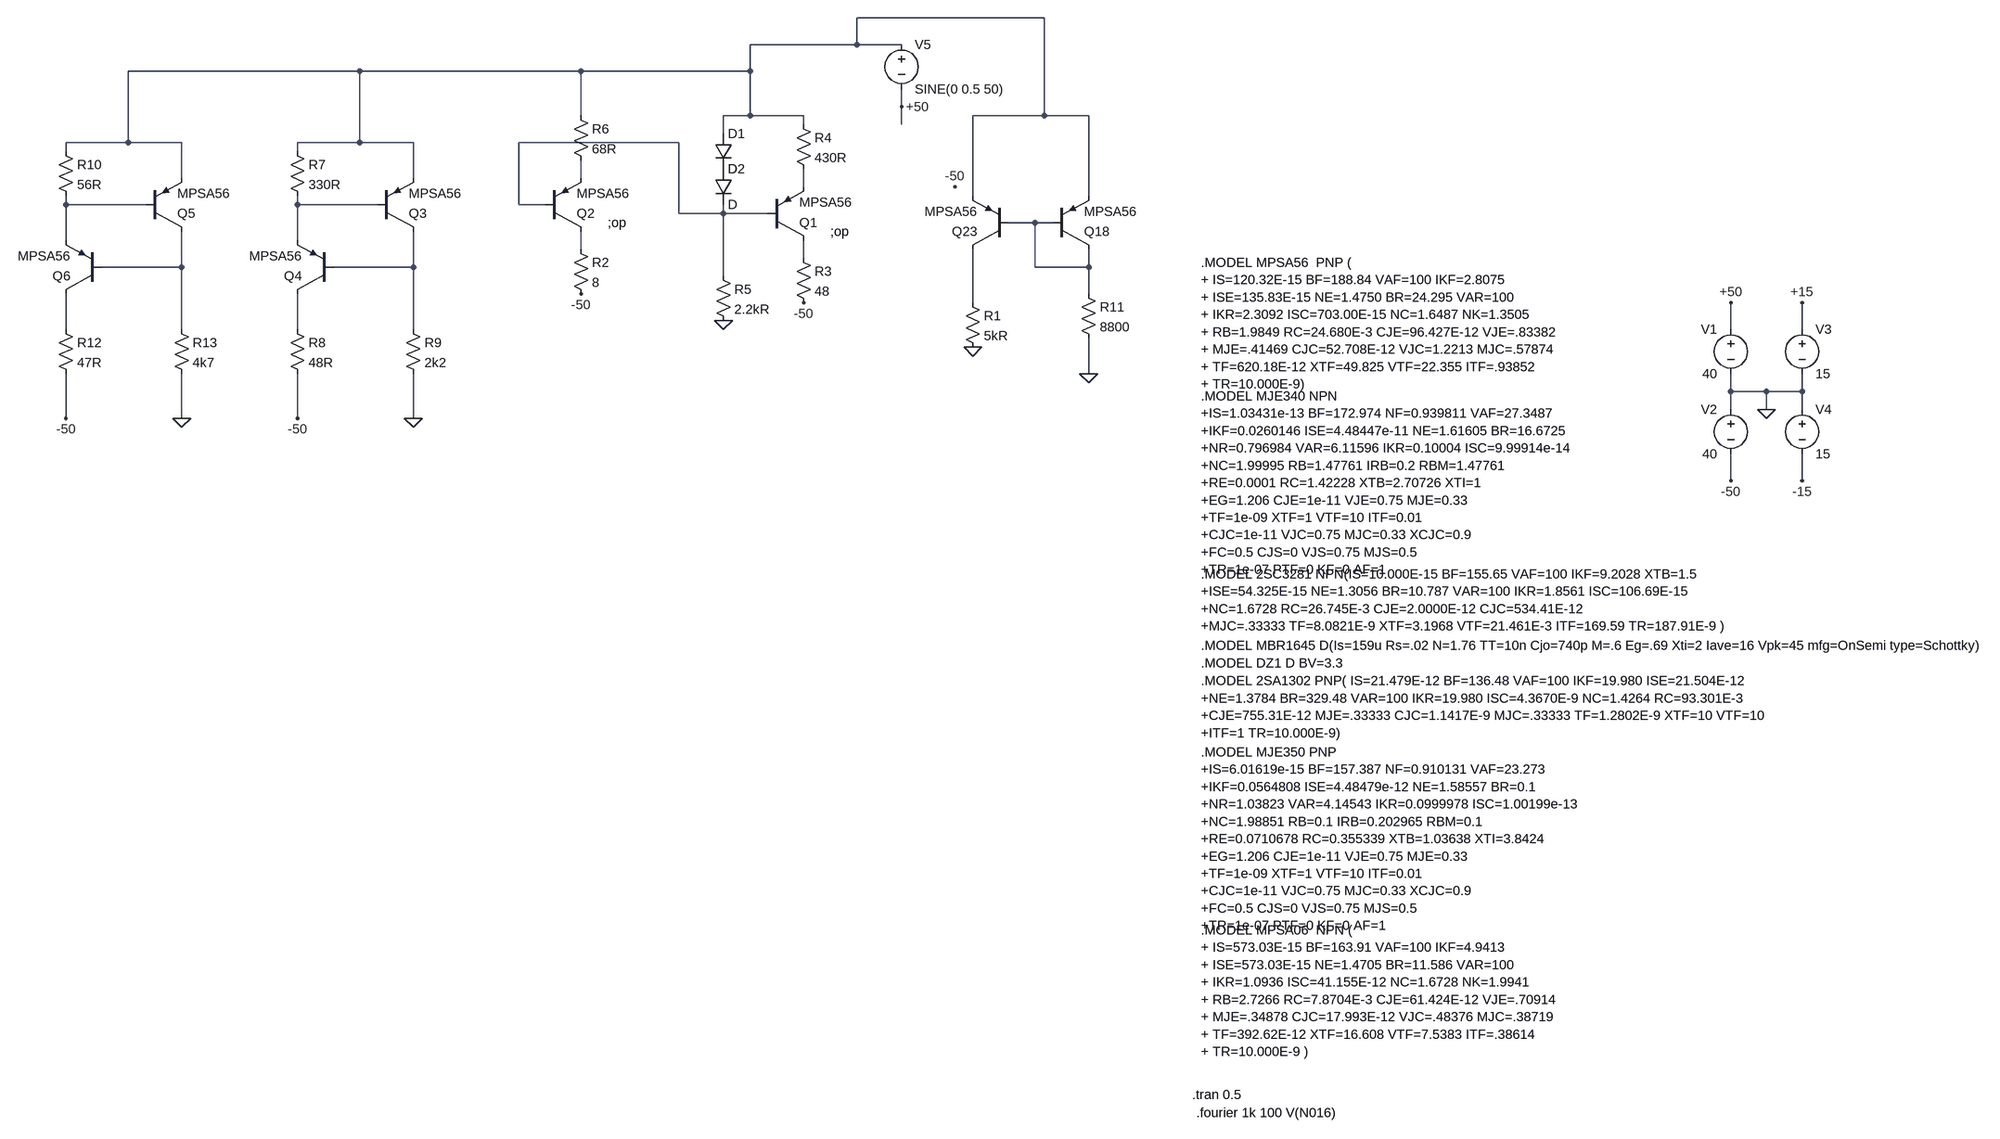
[diagram p0: schematic fuente_g.asc]
fuente_g.asc, the LTspice schematic file:
Version 4
SHEET 1 4608 680
WIRE 112 -1760 -224 -1760
WIRE -224 -1712 -224 -1760
WIRE -224 -1712 -416 -1712
WIRE -144 -1712 -224 -1712
WIRE -1184 -1664 -1600 -1664
WIRE -720 -1664 -1184 -1664
WIRE -416 -1664 -416 -1712
WIRE -416 -1664 -720 -1664
WIRE -144 -1600 -144 -1632
WIRE -720 -1584 -720 -1664
WIRE -416 -1584 -416 -1664
WIRE -416 -1584 -464 -1584
WIRE -320 -1584 -416 -1584
WIRE 112 -1584 112 -1760
WIRE 112 -1584 -16 -1584
WIRE 192 -1584 112 -1584
WIRE -320 -1568 -320 -1584
WIRE -144 -1568 -144 -1600
WIRE -464 -1552 -464 -1584
WIRE -1600 -1536 -1600 -1664
WIRE -1600 -1536 -1712 -1536
WIRE -1504 -1536 -1600 -1536
WIRE -1184 -1536 -1184 -1664
WIRE -1184 -1536 -1296 -1536
WIRE -1088 -1536 -1184 -1536
WIRE -544 -1536 -832 -1536
WIRE -1712 -1520 -1712 -1536
WIRE -1296 -1520 -1296 -1536
WIRE -1504 -1472 -1504 -1536
WIRE -1088 -1472 -1088 -1536
WIRE -720 -1472 -720 -1504
WIRE -320 -1472 -320 -1488
WIRE -320 -1456 -320 -1472
WIRE -16 -1440 -16 -1584
WIRE 192 -1440 192 -1584
WIRE -1712 -1424 -1712 -1440
WIRE -1568 -1424 -1712 -1424
WIRE -1296 -1424 -1296 -1440
WIRE -1152 -1424 -1296 -1424
WIRE -832 -1424 -832 -1536
WIRE -784 -1424 -832 -1424
WIRE -544 -1408 -544 -1536
WIRE -464 -1408 -464 -1424
WIRE -464 -1408 -544 -1408
WIRE -384 -1408 -464 -1408
WIRE 96 -1392 48 -1392
WIRE 128 -1392 96 -1392
WIRE -1712 -1360 -1712 -1424
WIRE -1296 -1360 -1296 -1424
WIRE -720 -1344 -720 -1376
WIRE -320 -1328 -320 -1360
WIRE -1504 -1312 -1504 -1376
WIRE -1504 -1312 -1648 -1312
WIRE -1088 -1312 -1088 -1376
WIRE -1088 -1312 -1232 -1312
WIRE 96 -1312 96 -1392
WIRE 192 -1312 192 -1344
WIRE 192 -1312 96 -1312
WIRE -464 -1296 -464 -1408
WIRE 192 -1264 192 -1312
WIRE -16 -1248 -16 -1344
WIRE -1712 -1200 -1712 -1264
WIRE -1504 -1200 -1504 -1312
WIRE -1296 -1200 -1296 -1264
WIRE -1088 -1200 -1088 -1312
WIRE 3936 -1200 3936 -1248
WIRE 4064 -1200 4064 -1248
WIRE 192 -1120 192 -1184
WIRE 3936 -1088 3936 -1120
WIRE 4000 -1088 3936 -1088
WIRE 4064 -1088 4064 -1120
WIRE 4064 -1088 4000 -1088
WIRE 3936 -1056 3936 -1088
WIRE 4000 -1056 4000 -1088
WIRE 4064 -1056 4064 -1088
WIRE -1712 -1040 -1712 -1120
WIRE -1504 -1040 -1504 -1120
WIRE -1296 -1040 -1296 -1120
WIRE -1088 -1040 -1088 -1120
WIRE 3936 -928 3936 -976
WIRE 4064 -928 4064 -976
FLAG 3936 -1248 +50
FLAG 3936 -928 -50
FLAG 4064 -1248 +15
FLAG 4064 -928 -15
FLAG 4000 -1056 0
FLAG 192 -1120 0
FLAG -16 -1168 0
FLAG -464 -1216 0
FLAG -144 -1600 +50
FLAG -48 -1456 -50
FLAG -320 -1248 -50
FLAG -720 -1264 -50
FLAG -1088 -1040 0
FLAG -1296 -1040 -50
FLAG -1504 -1040 0
FLAG -1712 -1040 -50
DATAFLAG -320 -1472 ""
DATAFLAG -464 -1408 ""
SYMBOL voltage 3936 -1216 M0
SYMATTR InstName V1
SYMATTR Value 40
SYMBOL voltage 3936 -1072 M0
SYMATTR InstName V2
SYMATTR Value 40
SYMBOL voltage 4064 -1216 R0
SYMATTR InstName V3
SYMATTR Value 15
SYMBOL voltage 4064 -1072 R0
SYMATTR InstName V4
SYMATTR Value 15
SYMBOL pnp 128 -1344 M180
SYMATTR InstName Q18
SYMATTR Value MPSA56
SYMBOL res 176 -1280 R0
SYMATTR InstName R11
SYMATTR Value 8800
SYMBOL pnp 48 -1344 R180
SYMATTR InstName Q23
SYMATTR Value MPSA56
SYMBOL res -32 -1264 R0
SYMATTR InstName R1
SYMATTR Value 5kR
SYMBOL diode -480 -1552 R0
SYMATTR InstName D1
SYMBOL diode -480 -1488 R0
SYMATTR InstName D2
SYMBOL pnp -384 -1360 M180
SYMATTR InstName Q1
SYMATTR Value MPSA56
SYMBOL res -336 -1344 R0
SYMATTR InstName R3
SYMATTR Value 48
SYMBOL res -336 -1584 R0
SYMATTR InstName R4
SYMATTR Value 430R
SYMBOL res -480 -1312 R0
SYMATTR InstName R5
SYMATTR Value 2.2kR
SYMBOL voltage -144 -1728 R0
WINDOW 123 0 0 Left 2
WINDOW 39 0 0 Left 2
SYMATTR InstName V5
SYMATTR Value SINE(0 0.5 50)
SYMBOL res -736 -1360 R0
SYMATTR InstName R2
SYMATTR Value 8
SYMBOL res -736 -1600 R0
SYMATTR InstName R6
SYMATTR Value 68R
SYMBOL pnp -784 -1376 M180
SYMATTR InstName Q2
SYMATTR Value MPSA56
SYMBOL pnp -1152 -1376 M180
SYMATTR InstName Q3
SYMATTR Value MPSA56
SYMBOL pnp -1232 -1264 R180
SYMATTR InstName Q4
SYMATTR Value MPSA56
SYMBOL res -1312 -1536 R0
SYMATTR InstName R7
SYMATTR Value 330R
SYMBOL res -1312 -1216 R0
SYMATTR InstName R8
SYMATTR Value 48R
SYMBOL res -1104 -1216 R0
SYMATTR InstName R9
SYMATTR Value 2k2
SYMBOL pnp -1568 -1376 M180
SYMATTR InstName Q5
SYMATTR Value MPSA56
SYMBOL pnp -1648 -1264 R180
SYMATTR InstName Q6
SYMATTR Value MPSA56
SYMBOL res -1728 -1536 R0
SYMATTR InstName R10
SYMATTR Value 56R
SYMBOL res -1728 -1216 R0
SYMATTR InstName R12
SYMATTR Value 47R
SYMBOL res -1520 -1216 R0
SYMATTR InstName R13
SYMATTR Value 4k7
TEXT 2984 -600 Left 2 !.MODEL DZ1 D BV=3.3
TEXT 2984 -1320 Left 2 !.MODEL MPSA56  PNP (\n+ IS=120.32E-15 BF=188.84 VAF=100 IKF=2.8075\n+ ISE=135.83E-15 NE=1.4750 BR=24.295 VAR=100\n+ IKR=2.3092 ISC=703.00E-15 NC=1.6487 NK=1.3505\n+ RB=1.9849 RC=24.680E-3 CJE=96.427E-12 VJE=.83382\n+ MJE=.41469 CJC=52.708E-12 VJC=1.2213 MJC=.57874\n+ TF=620.18E-12 XTF=49.825 VTF=22.355 ITF=.93852\n+ TR=10.000E-9)
TEXT 2984 -1080 Left 2 !.MODEL MJE340 NPN\n+IS=1.03431e-13 BF=172.974 NF=0.939811 VAF=27.3487\n+IKF=0.0260146 ISE=4.48447e-11 NE=1.61605 BR=16.6725\n+NR=0.796984 VAR=6.11596 IKR=0.10004 ISC=9.99914e-14\n+NC=1.99995 RB=1.47761 IRB=0.2 RBM=1.47761\n+RE=0.0001 RC=1.42228 XTB=2.70726 XTI=1\n+EG=1.206 CJE=1e-11 VJE=0.75 MJE=0.33\n+TF=1e-09 XTF=1 VTF=10 ITF=0.01\n+CJC=1e-11 VJC=0.75 MJC=0.33 XCJC=0.9\n+FC=0.5 CJS=0 VJS=0.75 MJS=0.5\n+TR=1e-07 PTF=0 KF=0 AF=1
TEXT 2984 -760 Left 2 !.MODEL 2SC3281 NPN(IS=10.000E-15 BF=155.65 VAF=100 IKF=9.2028 XTB=1.5\n+ISE=54.325E-15 NE=1.3056 BR=10.787 VAR=100 IKR=1.8561 ISC=106.69E-15\n+NC=1.6728 RC=26.745E-3 CJE=2.0000E-12 CJC=534.41E-12\n+MJC=.33333 TF=8.0821E-9 XTF=3.1968 VTF=21.461E-3 ITF=169.59 TR=187.91E-9 )
TEXT 2984 -632 Left 2 !.MODEL MBR1645 D(Is=159u Rs=.02 N=1.76 TT=10n Cjo=740p M=.6 Eg=.69 Xti=2 Iave=16 Vpk=45 mfg=OnSemi type=Schottky)
TEXT 2984 -568 Left 2 !.MODEL 2SA1302 PNP( IS=21.479E-12 BF=136.48 VAF=100 IKF=19.980 ISE=21.504E-12\n+NE=1.3784 BR=329.48 VAR=100 IKR=19.980 ISC=4.3670E-9 NC=1.4264 RC=93.301E-3\n+CJE=755.31E-12 MJE=.33333 CJC=1.1417E-9 MJC=.33333 TF=1.2802E-9 XTF=10 VTF=10\n+ITF=1 TR=10.000E-9)
TEXT 2984 -440 Left 2 !.MODEL MJE350 PNP\n+IS=6.01619e-15 BF=157.387 NF=0.910131 VAF=23.273\n+IKF=0.0564808 ISE=4.48479e-12 NE=1.58557 BR=0.1\n+NR=1.03823 VAR=4.14543 IKR=0.0999978 ISC=1.00199e-13\n+NC=1.98851 RB=0.1 IRB=0.202965 RBM=0.1\n+RE=0.0710678 RC=0.355339 XTB=1.03638 XTI=3.8424\n+EG=1.206 CJE=1e-11 VJE=0.75 MJE=0.33\n+TF=1e-09 XTF=1 VTF=10 ITF=0.01\n+CJC=1e-11 VJC=0.75 MJC=0.33 XCJC=0.9\n+FC=0.5 CJS=0 VJS=0.75 MJS=0.5\n+TR=1e-07 PTF=0 KF=0 AF=1
TEXT 2984 -120 Left 2 !.MODEL MPSA06  NPN (\n+ IS=573.03E-15 BF=163.91 VAF=100 IKF=4.9413\n+ ISE=573.03E-15 NE=1.4705 BR=11.586 VAR=100\n+ IKR=1.0936 ISC=41.155E-12 NC=1.6728 NK=1.9941\n+ RB=2.7266 RC=7.8704E-3 CJE=61.424E-12 VJE=.70914\n+ MJE=.34878 CJC=17.993E-12 VJC=.48376 MJC=.38719\n+ TF=392.62E-12 XTF=16.608 VTF=7.5383 ITF=.38614\n+ TR=10.000E-9 )
TEXT 2976 208 Left 2 !.fourier 1k 100 V(N016)
TEXT 2968 176 Left 2 !.tran 0.5
TEXT -272 -1376 Left 2 !;op
TEXT -672 -1392 Left 2 !;op

The netlist it stands for:
* fuente_g.asc
V1 +50 0 40
V2 0 -50 40
V3 +15 0 15
V4 0 -15 15
Q18 N007 N007 N001 0 MPSA56
R11 N007 0 8800
Q23 N012 N007 N001 0 MPSA56
R1 N012 0 5kR
D1 N001 P001 D
D2 P001 N002 D
Q1 N009 N002 N004 0 MPSA56
R3 N009 -50 48
R4 N001 N004 430R
R5 N002 0 2.2kR
V5 N001 +50 SINE(0 0.5 50)
R2 N008 -50 8
R6 N001 N003 68R
Q2 N008 N002 N003 0 MPSA56
Q3 N011 N006 N001 0 MPSA56
Q4 N014 N011 N006 0 MPSA56
R7 N001 N006 330R
R8 N014 -50 48R
R9 N011 0 2k2
Q5 N010 N005 N001 0 MPSA56
Q6 N013 N010 N005 0 MPSA56
R10 N001 N005 56R
R12 N013 -50 47R
R13 N010 0 4k7
.model D D
.lib standard.dio
.model NPN NPN
.model PNP PNP
.lib standard.bjt
.MODEL DZ1 D BV=3.3
.MODEL MPSA56  PNP (
+ IS=120.32E-15 BF=188.84 VAF=100 IKF=2.8075
+ ISE=135.83E-15 NE=1.4750 BR=24.295 VAR=100
+ IKR=2.3092 ISC=703.00E-15 NC=1.6487 NK=1.3505
+ RB=1.9849 RC=24.680E-3 CJE=96.427E-12 VJE=.83382
+ MJE=.41469 CJC=52.708E-12 VJC=1.2213 MJC=.57874
+ TF=620.18E-12 XTF=49.825 VTF=22.355 ITF=.93852
+ TR=10.000E-9)
.MODEL MJE340 NPN
+IS=1.03431e-13 BF=172.974 NF=0.939811 VAF=27.3487
+IKF=0.0260146 ISE=4.48447e-11 NE=1.61605 BR=16.6725
+NR=0.796984 VAR=6.11596 IKR=0.10004 ISC=9.99914e-14
+NC=1.99995 RB=1.47761 IRB=0.2 RBM=1.47761
+RE=0.0001 RC=1.42228 XTB=2.70726 XTI=1
+EG=1.206 CJE=1e-11 VJE=0.75 MJE=0.33
+TF=1e-09 XTF=1 VTF=10 ITF=0.01
+CJC=1e-11 VJC=0.75 MJC=0.33 XCJC=0.9
+FC=0.5 CJS=0 VJS=0.75 MJS=0.5
+TR=1e-07 PTF=0 KF=0 AF=1
.MODEL 2SC3281 NPN(IS=10.000E-15 BF=155.65 VAF=100 IKF=9.2028 XTB=1.5
+ISE=54.325E-15 NE=1.3056 BR=10.787 VAR=100 IKR=1.8561 ISC=106.69E-15
+NC=1.6728 RC=26.745E-3 CJE=2.0000E-12 CJC=534.41E-12
+MJC=.33333 TF=8.0821E-9 XTF=3.1968 VTF=21.461E-3 ITF=169.59 TR=187.91E-9 )
.MODEL MBR1645 D(Is=159u Rs=.02 N=1.76 TT=10n Cjo=740p M=.6 Eg=.69 Xti=2 Iave=16 Vpk=45 mfg=OnSemi type=Schottky)
.MODEL 2SA1302 PNP( IS=21.479E-12 BF=136.48 VAF=100 IKF=19.980 ISE=21.504E-12
+NE=1.3784 BR=329.48 VAR=100 IKR=19.980 ISC=4.3670E-9 NC=1.4264 RC=93.301E-3
+CJE=755.31E-12 MJE=.33333 CJC=1.1417E-9 MJC=.33333 TF=1.2802E-9 XTF=10 VTF=10
+ITF=1 TR=10.000E-9)
.MODEL MJE350 PNP
+IS=6.01619e-15 BF=157.387 NF=0.910131 VAF=23.273
+IKF=0.0564808 ISE=4.48479e-12 NE=1.58557 BR=0.1
+NR=1.03823 VAR=4.14543 IKR=0.0999978 ISC=1.00199e-13
+NC=1.98851 RB=0.1 IRB=0.202965 RBM=0.1
+RE=0.0710678 RC=0.355339 XTB=1.03638 XTI=3.8424
+EG=1.206 CJE=1e-11 VJE=0.75 MJE=0.33
+TF=1e-09 XTF=1 VTF=10 ITF=0.01
+CJC=1e-11 VJC=0.75 MJC=0.33 XCJC=0.9
+FC=0.5 CJS=0 VJS=0.75 MJS=0.5
+TR=1e-07 PTF=0 KF=0 AF=1
.MODEL MPSA06  NPN (
+ IS=573.03E-15 BF=163.91 VAF=100 IKF=4.9413
+ ISE=573.03E-15 NE=1.4705 BR=11.586 VAR=100
+ IKR=1.0936 ISC=41.155E-12 NC=1.6728 NK=1.9941
+ RB=2.7266 RC=7.8704E-3 CJE=61.424E-12 VJE=.70914
+ MJE=.34878 CJC=17.993E-12 VJC=.48376 MJC=.38719
+ TF=392.62E-12 XTF=16.608 VTF=7.5383 ITF=.38614
+ TR=10.000E-9 )
.fourier 1k 100 V(N016)
.tran 0.5
;op
;op
.backanno
.end